# EAGLE design Grove - 3-Axis Digital Accelerometer(±1.5g) v1.2 (EAGLE 6.3)
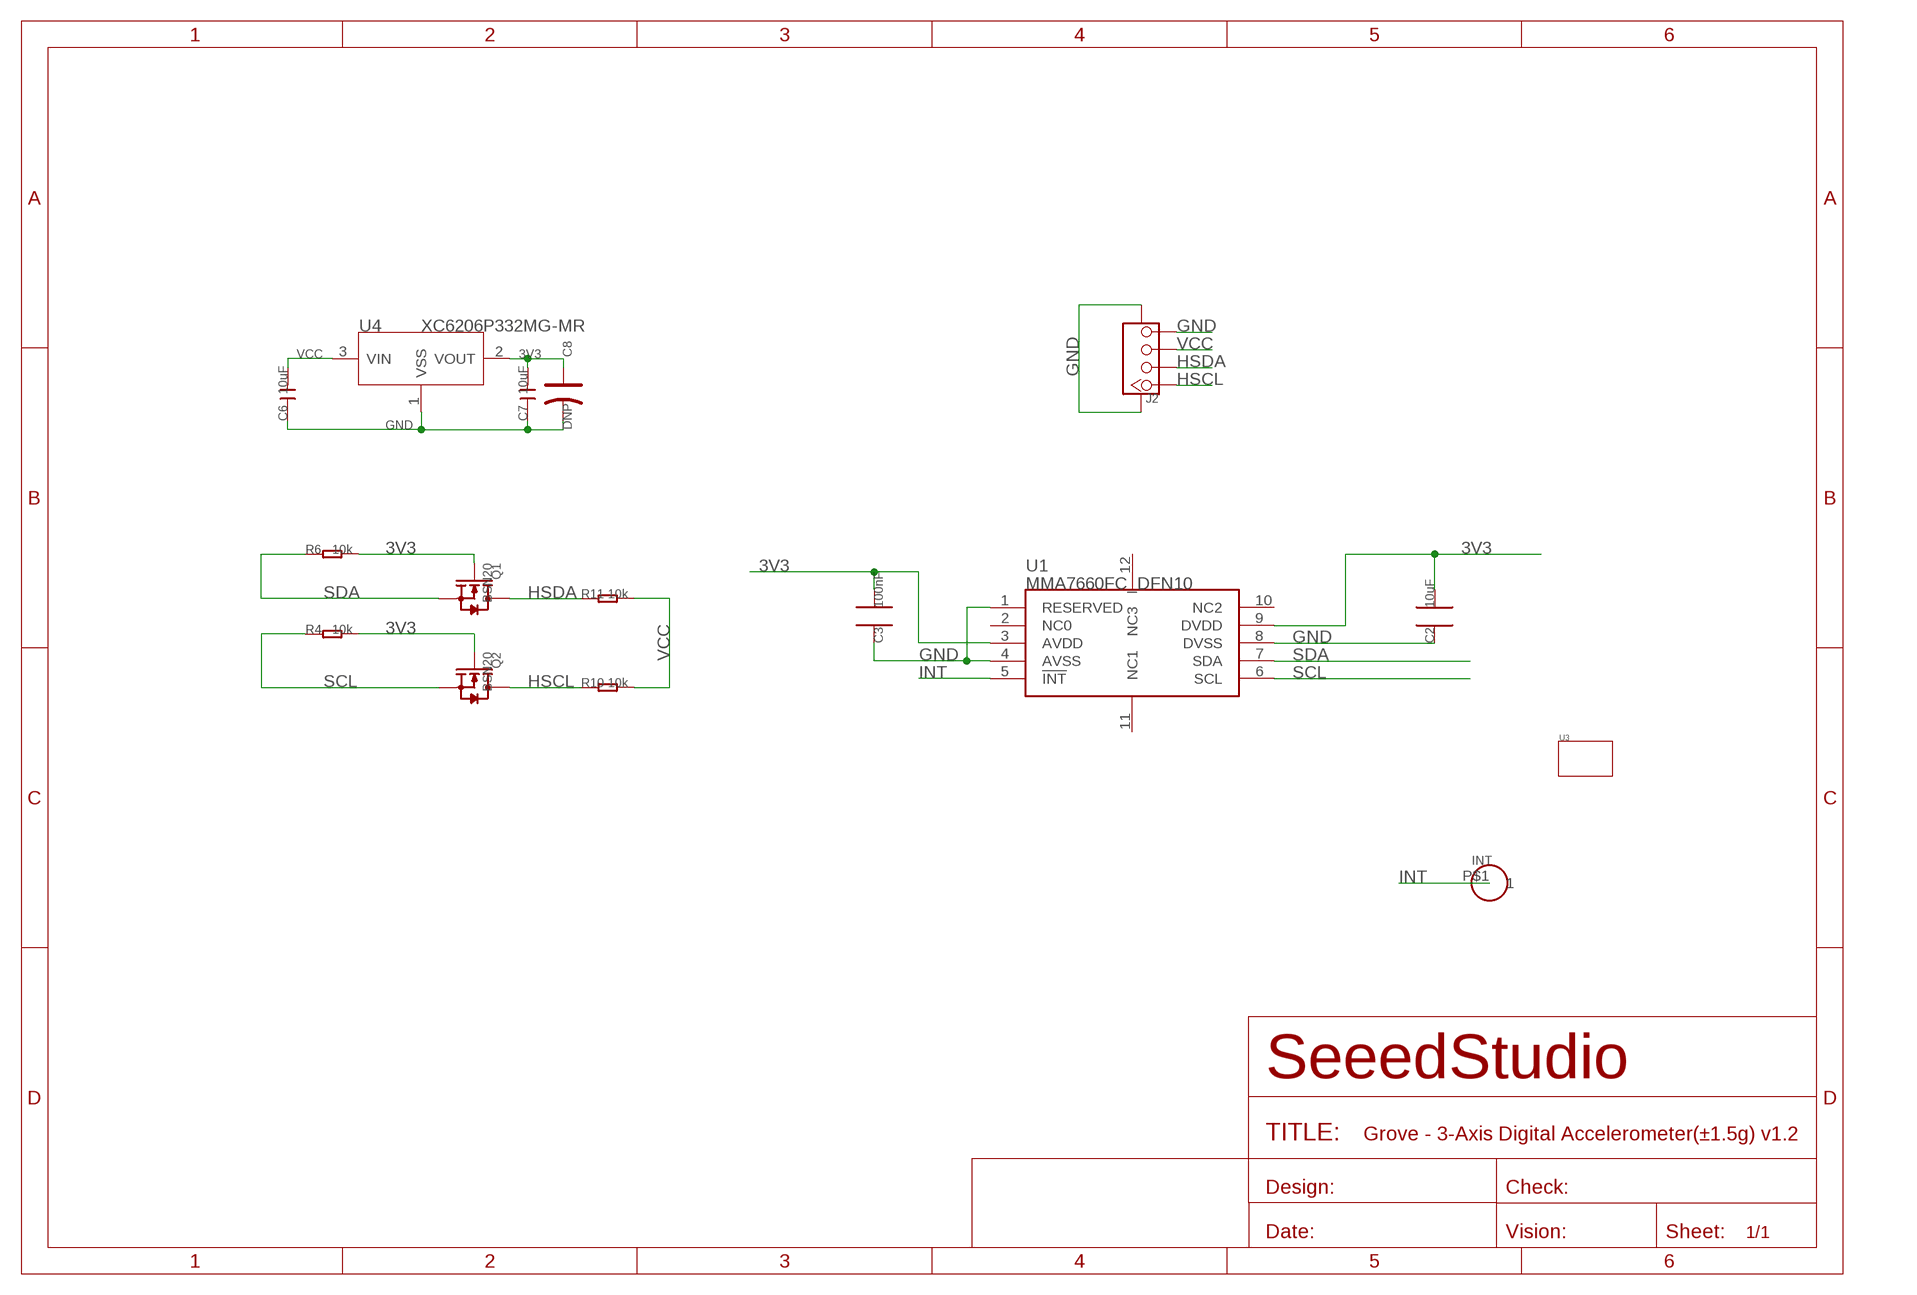
[diagram p0: schematic, sheet 1]

## Parts
C2  10uF  C0805_S  [0805_S]
C3  100nF  C0603_S  [0603_S]
C6  10uF  C-0805  [C0805]
C7  10uF  C-0805  [C0805]
C8  DNP  CAP-AVX-A  [AVX-A]
INT  HEADER-1P-35  [1P-65/35MIL]
J2  TWIG-4P-2.0-SMD-FEMALE-REINFORCE'DD'  [4P-SMD-2.0]
Q1  BSN20  MOSFET-N'SOT23'  [SOT23]
Q2  BSN20  MOSFET-N'SOT23'  [SOT23]
R4  10k  R-0603  [R0603]
R6  10k  R-0603  [R0603]
R10  10k  R-0603  [R0603]
R11  10k  R-0603  [R0603]
U1  MMA7660FC_DFN10  [DFN10]
U3  TWIG-1U  [1U-DIM-W/-DRILL]
U4  XC6206P332MG-MR  XC6206MR  [SOT23]

## Nets
3V3: C2.2 C3.2 C7.2 C8.+ Q1.1(G) Q2.1(G) R4.2 R6.2 U1.3(AVDD) U1.9(DVDD) U4.2(VOUT)
GND: C2.1 C3.1 C6.1 C7.1 C8.- J2.4 J2.SS1 J2.SS2 U1.1(RESERVED) U1.4(AVSS) U1.8(DVSS) U4.1(VSS)
HSCL: J2.1 Q2.3(D) R10.1
HSDA: J2.2 Q1.3(D) R11.1
INT: INT.P$1 U1.5(!INT)
SCL: Q2.2(S) R4.1 U1.6(SCL)
SDA: Q1.2(S) R6.1 U1.7(SDA)
VCC: C6.2 J2.3 R10.2 R11.2 U4.3(VIN)
Unconnected: U1.2(NC0) U1.10(NC2) U1.11(NC1) U1.12(NC3)

## Library data of the parts
C2 = CPT_SMD:C0805
C3 = CPT_SMD:C0603
C6 C7 = Discrete:C*: Ceramic Capacitors
C8 = Discrete:CAP*: Electrolytic Capacitors,Tantalum Capacitors and Super Capacitors
INT = Connector:HEADER-1P
J2 = Connector:TWIG-4P-2.0-SMD-FEMALE-REINFORCE
Q1 Q2 = Discrete:MOSFET-N: IRLL014: http://www.vishay.com/docs/91319/sihll014.pdf
R4 R6 R10 R11 = Discrete:R*
U1 = ICs_v54:MMA7660FC
U3 = Module:TWIG
U4 = IC:XC6206: LOW ESR Cap.Compatible Positive Voltage Regulators

## Net classes
0 default: width 0.203 mm, drill 0.305 mm, clearance 0.203 mm

## Board
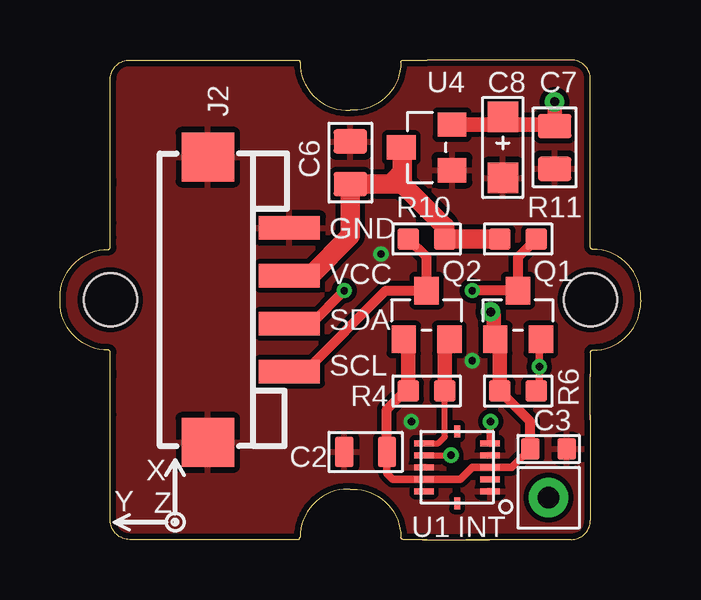
[diagram p1: board, top side]
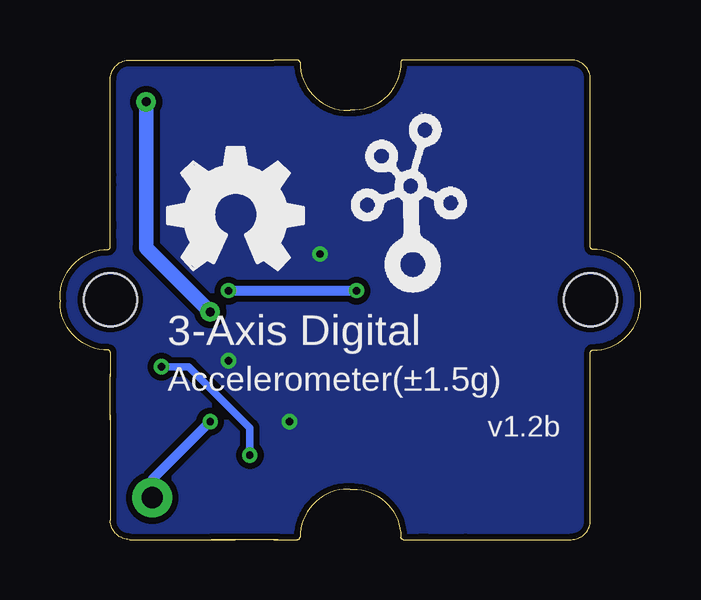
[diagram p2: board, bottom side, seen from below]

Size 24.2 x 20 mm. Coordinates in mm from the lower left corner, seen from the top.
Copper layers (1*16): Top 0.035mm / dielectric 1.5mm / Bottom 0.035mm
Design rules "default": minimum track width 6mil, minimum drill 12mil, track to track 6mil, track to pad 6mil, pad to pad 6mil, via to via 6mil, smd to smd 0mil, copper to edge 10mil, drill to drill 10mil, minimum pad ring 10mil, minimum via ring 6mil, stop-mask expansion 2mil, vias tented up to drill 100mil, thermal gap 10mil

### Footprints (pad centres in the part's own frame; a part is rotated, then mirrored left to right if it is on the bottom)
0805_S = smd 0.762 x 1.27: 1 -0.889,0; 2 0.889,0
0603_S = smd 0.762 x 0.889: 1 -0.762,0; 2 0.762,0
C0805 = smd 1.016 x 1.397: 1 -0.889,0; 2 0.889,0
AVX-A = smd 1.27 x 1.27: + -1.27,0; - 1.27,0
1P-65/35MIL = drill 0.889 pad 1.651: P$1 0,0
4P-SMD-2.0 = smd 0.965 x 2.54: 1 -3,0; 2 -1,0; 3 1,0; 4 3,0 | smd 2.032 x 2.184: SS1 -5.946,3.4; SS2 5.946,3.4
SOT23 = smd 1.016 x 1.143: 1 -0.95,-1.016; 2 0.95,-1.016; 3 0,1.016
R0603 = smd 0.889 x 0.889: 1 -0.762,0; 2 0.762,0
DFN10 = smd 0.8 x 0.25: 1 -1.375,1; 2 -1.375,0.5; 3 -1.375,0; 4 -1.375,-0.5; 5 -1.375,-1; 6 1.375,-1; 7 1.375,-0.5; 8 1.375,0; 9 1.375,0.5; 10 1.375,1 | smd 0.25 x 0.5: 11 0,-1.5; 12 0,1.5
1U-DIM-W/-DRILL = hole 2.2: 0,-10; 0,10
SOT23' = smd 1.016 x 1.2: 1 -0.95,-1.06; 2 0.95,-1.06; 3 0,1.06

### Placement (x,y rotation side)
C2  12.73,3.65 0 top
C3  20.36,3.78 180 top
C6  12.1,15.71 270 top
C7  20.61,16.35 90 top
C8  18.45,16.35 270 top
INT  20.36,1.74 270 top
J2  9.56,10 90 top
Q1  19.09,9.37 0 top
Q2  15.27,9.37 0 top
R4  15.27,6.19 180 top
R6  19.09,6.19 180 top
R10  15.27,12.54 0 top
R11  19.09,12.54 180 top
U1  16.55,3.01 180 top
U3  12.1,10 90 top
U4  XC6206P332MG-MR  [SOT23']  15.27,16.35 90 top
U$1  [OSHW_FILLX200_NOTEXT]  19.72,11.27 0 bottom
U$3  [TWIGLOGO]  9.56,11.27 0 bottom

### Tracks (layer width: path | path; a pad name or v marks a point on that pad's centre or on a via)
3V3  (via drill 0.38 pad 0.81)
  Top 0.305: C2.2 13.62,2.76 13.87,2.51 U1.9 16.68,2.51 17.18,3.01 U1.3 18.83,3.01 C3.2
  Top 0.406: C3.2 19.59,4.92 R6.2 | C2.2 13.62,5.43 14.51,6.32
  Top 0.61: R4.2 14.51,6.32 14.51,8.16 Q2.1 | R6.2 18.32,8.16 Q1.1 18.07,8.41 18.07,9.37 v17.94,9.49 | U4.2 18.13,17.3 | 18.13,17.3 C8.+ | 18.13,17.3 20.67,17.3 C7.2 v20.61,18.26
  Bottom 0.61: v20.61,18.26 20.61,12.16 v17.94,9.49
GND  (via drill 0.3 pad 0.64)
  other vias: 14.64,4.92 17.18,7.46 13.37,11.9
  pour Top (isolate 0.203): 24.16,-0.29 -0.09,-0.41 -0.22,20.8 24.29,20.92
  pour Bottom (isolate 0.254): 24.16,-0.29 -0.09,-0.41 -0.22,20.8 24.29,20.92
HSCL
  Top 0.406: R10.1 15.27,11.78 Q2.3 13.58,10.38 10.2,7 | J2.1 10.2,7 | 10.2,7 10.5,7
HSDA  (via drill 0.3 pad 0.64)
  Top 0.406: R11.1 19.09,11.78 Q1.3 v17.18,10.38 | J2.2 10.46,9 v11.85,10.38
  Bottom 0.406: v17.18,10.38 v11.85,10.38
INT  (via drill 0.3 pad 0.64)
  Top 0.305: U1.5 17.92,4.9 v17.94,4.92
  Bottom 0.406: INT.P$1 20.36,2.51 v17.94,4.92
SCL
  Top 0.254: U1.6 15.77,4.01 16.04,4.29 R4.1
  Top 0.61: R4.1 16.04,8.16 Q2.2
SDA  (via drill 0.3 pad 0.64)
  Top 0.254: U1.7 v16.28,3.51 v16.29,3.52
  Top 0.305: Q1.2 19.97,8.29 v19.97,7.21 19.97,6.19 R6.1
  Bottom 0.305: v19.97,7.21 18.83,7.21 16.29,4.67 v16.29,3.52
VCC
  Top 0.813: J2.3 9.58,11.02 10.45,11.02 12.1,12.67 C6.2 | R11.2 R10.2 16.04,13.05 14.26,14.83 14.26,14.95 | 14.26,14.95 14.26,16.31 U4.3 | C6.2 13.75,14.83 | 13.75,14.83 14.13,14.83 14.26,14.95 | 13.75,14.83 14.13,15.21 | C6.2 11.85,14.83

### Text on the board
tPlace: GND | VCC | SDA | SCL
bPlace: 3-Axis Digital | Accelerometer(±1.5g) | v1.2b
tNames: X | Y | Z